# EAGLE design supply (EAGLE 4.13)
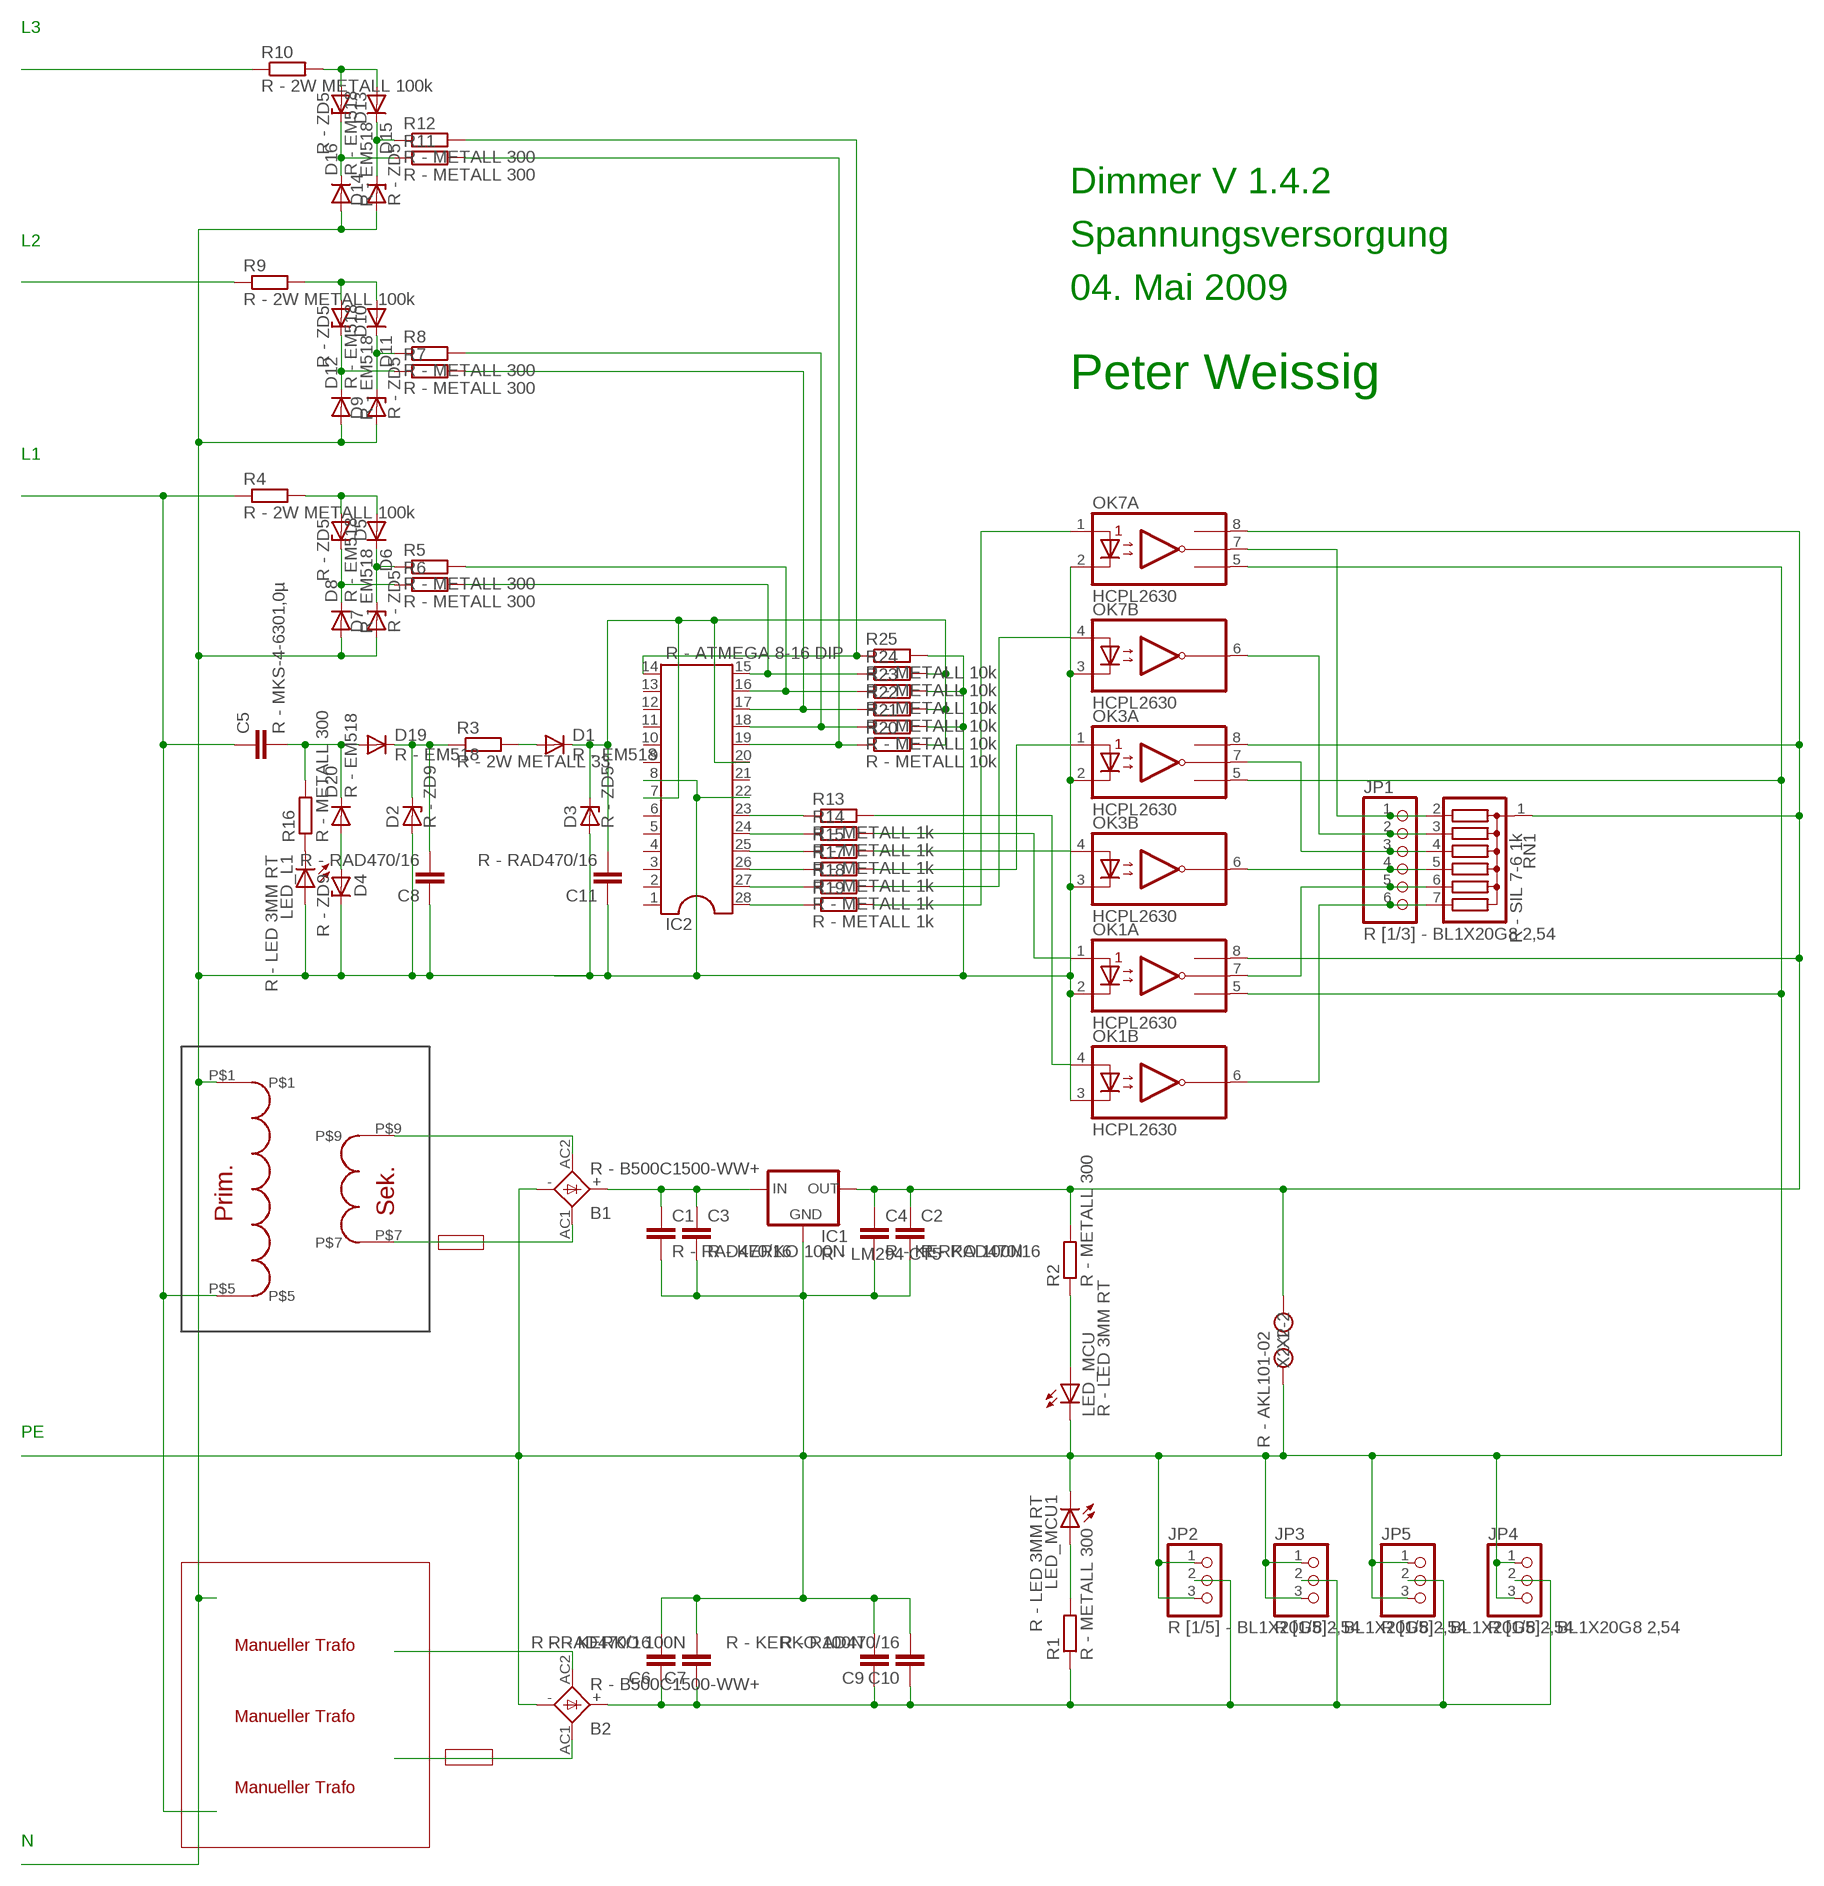
[diagram p0: schematic, sheet 1]

## Parts
B1  R - B500C1500-WW+  2KBP  [2KBP]
B2  R - B500C1500-WW+  2KBP  [2KBP]
C1  R - RAD470/16  C-EU050-075X075  [C050-075X075]
C2  R - RAD470/16  C-EU050-075X075  [C050-075X075]
C3  R - KERKO 100N  C-EU050-025X075  [C050-025X075]
C4  R - KERKO 100N  C-EU050-025X075  [C050-025X075]
C5  R - MKS-4-6301,0µ  C-EU275-134X316  [C275-134X316]
C6  R - RAD470/16  C-EU050-075X075  [C050-075X075]
C7  R - KERKO 100N  C-EU050-025X075  [C050-025X075]
C8  R - RAD470/16  C-EU050-075X075  [C050-075X075]
C9  R - KERKO 100N  C-EU050-025X075  [C050-025X075]
C10  R - RAD470/16  C-EU050-075X075  [C050-075X075]
C11  R - RAD470/16  C-EU050-075X075  [C050-075X075]
D1  R - EM518  1N4004  [DO41-10]
D2  R - ZD9  BZX85  [DO41Z10]
D3  R - ZD5  BZX85  [DO41Z10]
D4  R - ZD9  BZX85  [DO41Z10]
D5  R - ZD5  BZX85  [DO41Z10]
D6  R - EM518  1N4004  [DO41-10]
D7  R - ZD5  BZX85  [DO41Z10]
D8  R - EM518  1N4004  [DO41-10]
D9  R - ZD5  BZX85  [DO41Z10]
D10  R - ZD5  BZX85  [DO41Z10]
D11  R - EM518  1N4004  [DO41-10]
D12  R - EM518  1N4004  [DO41-10]
D13  R - ZD5  BZX85  [DO41Z10]
D14  R - ZD5  BZX85  [DO41Z10]
D15  R - EM518  1N4004  [DO41-10]
D16  R - EM518  1N4004  [DO41-10]
D19  R - EM518  1N4004  [DO41-10]
D20  R - EM518  1N4004  [DO41-10]
IC1  R - LM294 CT5  78XXS  [78XXS]
IC2  R - ATMEGA 8-16 DIP  DIL28-3  [DIL28-3]
JP1  R [1/3] - BL1X20G8 2,54  PINHD-1X6  [1X06]
JP2  R [1/5] - BL1X20G8 2,54  PINHD-1X3  [1X03]
JP3  R [1/5] - BL1X20G8 2,54  PINHD-1X3  [1X03]
JP4  R [1/5] - BL1X20G8 2,54  PINHD-1X3  [1X03]
JP5  R [1/5] - BL1X20G8 2,54  PINHD-1X3  [1X03]
LED_L1  R - LED 3MM RT  LED3MM  [LED3MM]
LED_MCU  R - LED 3MM RT  LED3MM  [LED3MM]
LED_MCU1  R - LED 3MM RT  LED3MM  [LED3MM]
OK1  HCPL2630  [DIL08]
OK3  HCPL2630  [DIL08]
OK7  HCPL2630  [DIL08]
R1  R - METALL 300  R-EU_0207/10  [0207/10]
R2  R - METALL 300  R-EU_0207/10  [0207/10]
R3  R - 2W METALL 33  R-EU_0617/17  [0617/17]
R4  R - 2W METALL 100k  R-EU_0617/17  [0617/17]
R5  R - METALL 300  R-EU_0207/10  [0207/10]
R6  R - METALL 300  R-EU_0207/10  [0207/10]
R7  R - METALL 300  R-EU_0207/10  [0207/10]
R8  R - METALL 300  R-EU_0207/10  [0207/10]
R9  R - 2W METALL 100k  R-EU_0617/17  [0617/17]
R10  R - 2W METALL 100k  R-EU_0617/17  [0617/17]
R11  R - METALL 300  R-EU_0207/10  [0207/10]
R12  R - METALL 300  R-EU_0207/10  [0207/10]
R13  R - METALL 1k  R-EU_0207/10  [0207/10]
R14  R - METALL 1k  R-EU_0207/10  [0207/10]
R15  R - METALL 1k  R-EU_0207/10  [0207/10]
R16  R - METALL 300  R-EU_0207/10  [0207/10]
R17  R - METALL 1k  R-EU_0207/10  [0207/10]
R18  R - METALL 1k  R-EU_0207/10  [0207/10]
R19  R - METALL 1k  R-EU_0207/10  [0207/10]
R20  R - METALL 10k  R-EU_0207/10  [0207/10]
R21  R - METALL 10k  R-EU_0207/10  [0207/10]
R22  R - METALL 10k  R-EU_0207/10  [0207/10]
R23  R - METALL 10k  R-EU_0207/10  [0207/10]
R24  R - METALL 10k  R-EU_0207/10  [0207/10]
R25  R - METALL 10k  R-EU_0207/10  [0207/10]
RN1  R - SIL 7-6 1k  G06R  [SIL7]
U$1  R - 387.06-1  TRAFO387  [TRAFO387]
X2  R - AKL101-02  W237-102  [W237-102]

## Nets
GND: B1.- B2.- C1.2 C2.2 C3.2 C4.2 C6.2 C7.2 C9.2 C10.2 IC1.GND JP2.1 JP2.3 JP3.1 JP3.3 JP4.1 JP4.3 JP5.1 JP5.3 LED_MCU1.K(C) LED_MCU.K(C) OK1.5(A:GND) OK3.5(A:GND) OK7.5(A:GND) X2.2
N$2: B1.AC1 U$1.P$7
N$3: B1.+ C1.1 C3.1 IC1.IN
N$4: LED_MCU.A R2.1
N$5: D1.A R3.2
N$6: C8.2 D2.C D19.C R3.1
N$7: C11.2 D1.C D3.C IC2.7 IC2.20 R20.2 R22.2 R24.2
N$8: C5.2 D19.A D20.C R16.2
N$9: R9.1
N$11: D4.A D20.A
N$12: R10.1
N$13: OK1.4(B:A2) R13.2
N$14: OK7.1(A:A1) R19.2
N$15: OK3.4(B:A2) R15.2
N$16: B1.AC2 U$1.P$9
N$17: B2.AC1
N$18: B2.+ C6.1 C7.1 C9.1 C10.1 JP2.2 JP3.2 JP4.2 JP5.2 R1.1
N$19: LED_MCU1.A R1.2
N$20: B2.AC2
N$22: OK1.1(A:A1) R14.2
N$23: IC2.23 R13.1
N$24: OK3.1(A:A1) R17.2
N$25: OK7.4(B:A2) R18.2
N$26: IC2.24 R14.1
N$27: JP1.6 OK1.6(B:VO2) RN1.7
N$28: JP1.1 OK7.7(A:VO1) RN1.2
N$29: JP1.5 OK1.7(A:VO1) RN1.6
N$30: IC2.25 R15.1
N$32: IC2.26 R17.1
N$33: IC2.27 R18.1
N$34: IC2.28 R19.1
N$36: JP1.4 OK3.6(B:VO2) RN1.5
N$37: JP1.3 OK3.7(A:VO1) RN1.4
N$38: IC2.14 R12.2 R25.1
N$39: D5.A D6.A R4.2
N$40: D5.C D8.C R6.1
N$42: IC2.16 R5.2 R23.1
N$43: D6.C D7.C R5.1
N$44: IC2.19 R11.2 R20.1
N$45: JP1.2 OK7.6(B:VO2) RN1.3
N$46: IC2.15 R6.2 R24.1
N$48: IC2.18 R8.2 R21.1
N$50: LED_L1.K(C) R16.1
N$51: IC2.17 R7.2 R22.1
N$54: D13.C D16.C R11.1
N$55: D13.A D15.A R10.2
N$56: D10.C D12.C R7.1
N$57: D9.C D11.C R8.1
N$58: D10.A D11.A R9.2
N$59: D14.C D15.C R12.1
NULLLEITER: C8.1 C11.1 D2.A D3.A D4.C D7.A D8.A D9.A D12.A D14.A D16.A IC2.8 IC2.22 LED_L1.A OK1.2(A:C1) OK1.3(B:C2) OK3.2(A:C1) OK3.3(B:C2) OK7.2(A:C1) OK7.3(B:C2) R21.2 R23.2 R25.2 U$1.P$1
PHASE1: C5.1 R4.1 U$1.P$5
VCC: C2.1 C4.1 IC1.OUT OK1.8(A:VCC) OK3.8(A:VCC) OK7.8(A:VCC) R2.2 RN1.1 X2.1
Unconnected: IC2.1 IC2.2 IC2.3 IC2.4 IC2.5 IC2.6 IC2.9 IC2.10 IC2.11 IC2.12 IC2.13 IC2.21

## Notes on the sheet
- L3
- Dimmer V 1.4.2
- L2 | Spannungsversorgung
- 04. Mai 2009
- Peter Weissig
- L1
- PE
- Manueller Trafo
- Manueller Trafo
- Manueller Trafo
- N

## Library data of the parts
B1 B2 = rectifier:2KBP: RECTIFIER grid 3 x 3,81 mm
C1-C11 = rcl:C-EU: CAPACITOR, European symbol
D1 D6 D8 D11 D12 D15 D16 D19 D20 = diode:1N4004: DIODE general purpose rectifier, 1 A
D2-D5 D7 D9 D10 D13 D14 = diode:BZX85: Z DIODE
IC1 = v-reg:78XXS: VOLTAGE REGULATOR
IC2 = ic-package:DIL28: Dual In Line
JP1 = pinhead:PINHD-1X6: PIN HEADER
JP2-JP5 = pinhead:PINHD-1X3: PIN HEADER
LED_L1 LED_MCU LED_MCU1 = led:LED: LED OSRAM: - CHIPLED LG R971, LG N971, LY N971, LG Q971, LY Q971, LO R971, LY R971 LH N974, LH R974 LS Q976, LO Q976, LY Q976 LO Q996 - Hyper CHIPLED LW Q18S LB Q993, LB Q99A, LB R99A - SideLED LS A670, LO A670, LY A670, LG A670, LP A670 LB A673, LV A673, LT A673, LW A673 LH A674 LY A675 LS A676, LA A676, LO A676, LY A676, LW A676 LS A679, LY A679, LG A679 - Hyper Micro SIDELED® LS Y876, LA Y876, LO Y876, LY Y876 LT Y87S - SmartLED LW L88C, LW L88S LB L89C, LB L89S, LG L890 LS L89K, LO L89K, LY L89K LS L896, LA L896, LO L896, LY L896 - TOPLED LS T670, LO T670, LY T670, LG T670, LP T670 LSG T670, LSP T670, LSY T670, LOP T670, LYG T670 LG T671, LOG T671, LSG T671 LB T673, LV T673, LT T673, LW T673 LH T674 LS T676, LA T676, LO T676, LY T676, LB T676, LH T676, LSB T676, LW T676 LB T67C, LV T67C, LT T67C, LS T67K, LO T67K, LY T67K, LW E67C LS E67B, LA E67B, LO E67B, LY E67B, LB E67C, LV E67C, LT E67C LW T67C LS T679, LY T679, LG T679 LS T770, LO T770, LY T770, LG T770, LP T770 LB T773, LV T773, LT T773, LW T773 LH T774 LS E675, LA E675, LY E675, LS T675 LS T776, LA T776, LO T776, LY T776, LB T776 LHGB T686 LT T68C, LB T68C - Hyper Mini TOPLED® LB M676 - Mini TOPLED Santana® LG M470 LS M47K, LO M47K, LY M47K Source: http://www.osram.convergy.de/
OK1 OK3 OK7 = optocoupler:HCPL2630: HEWLETT PACKARD OPTO COUPLER
R1-R25 = rcl:R-EU_: RESISTOR, European symbol
RN1 = resistor-sil:G06R: SIL RESISTOR
U$1 = Meine eigene:TRAFO387
X2 = con-wago-500:W237-102: WAGO SCREW CLAMP

## Board
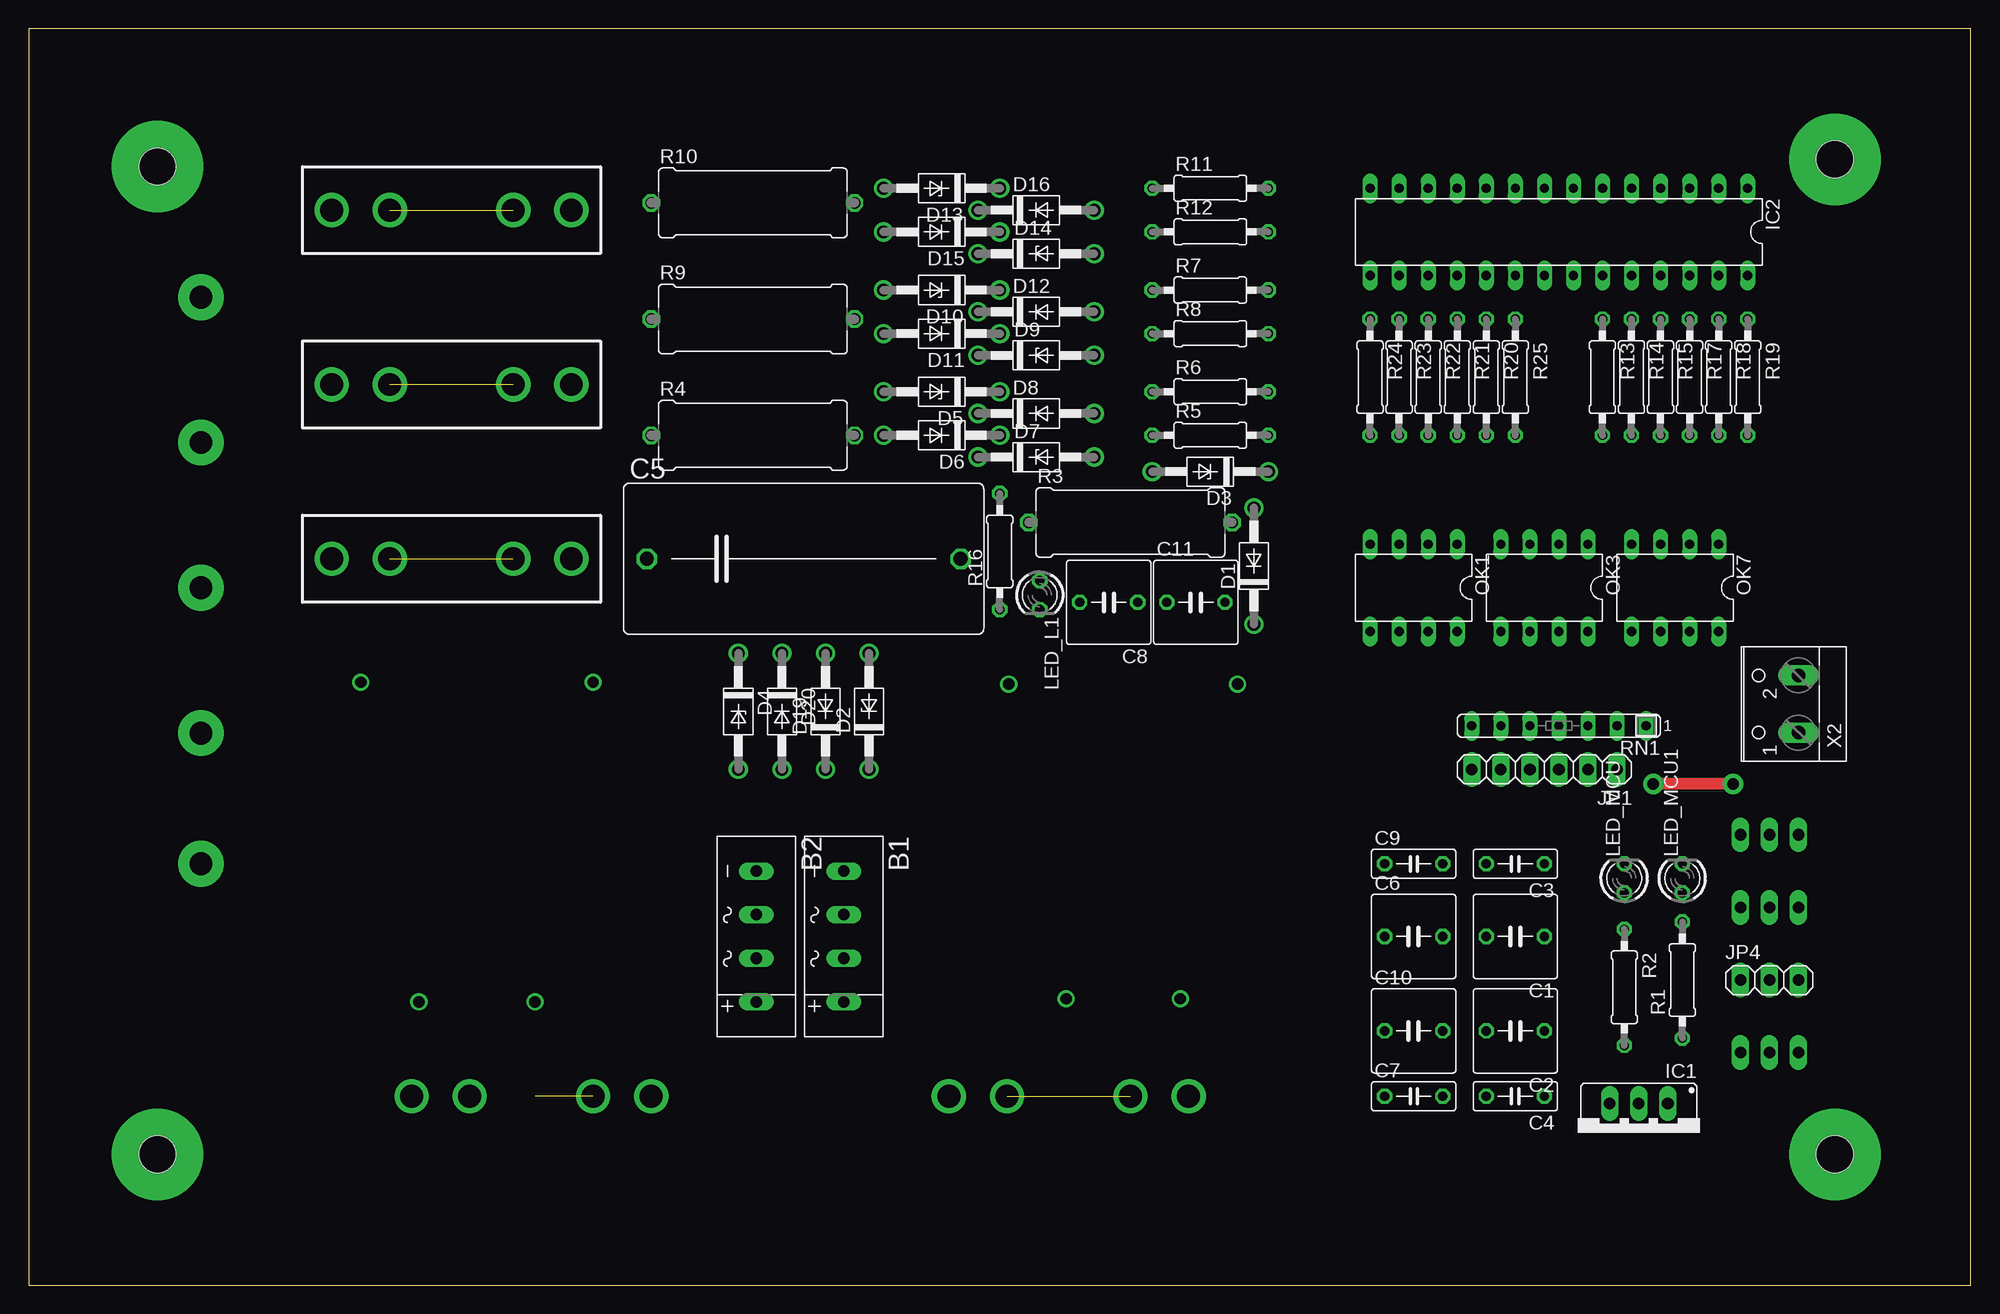
[diagram p1: board, top side]
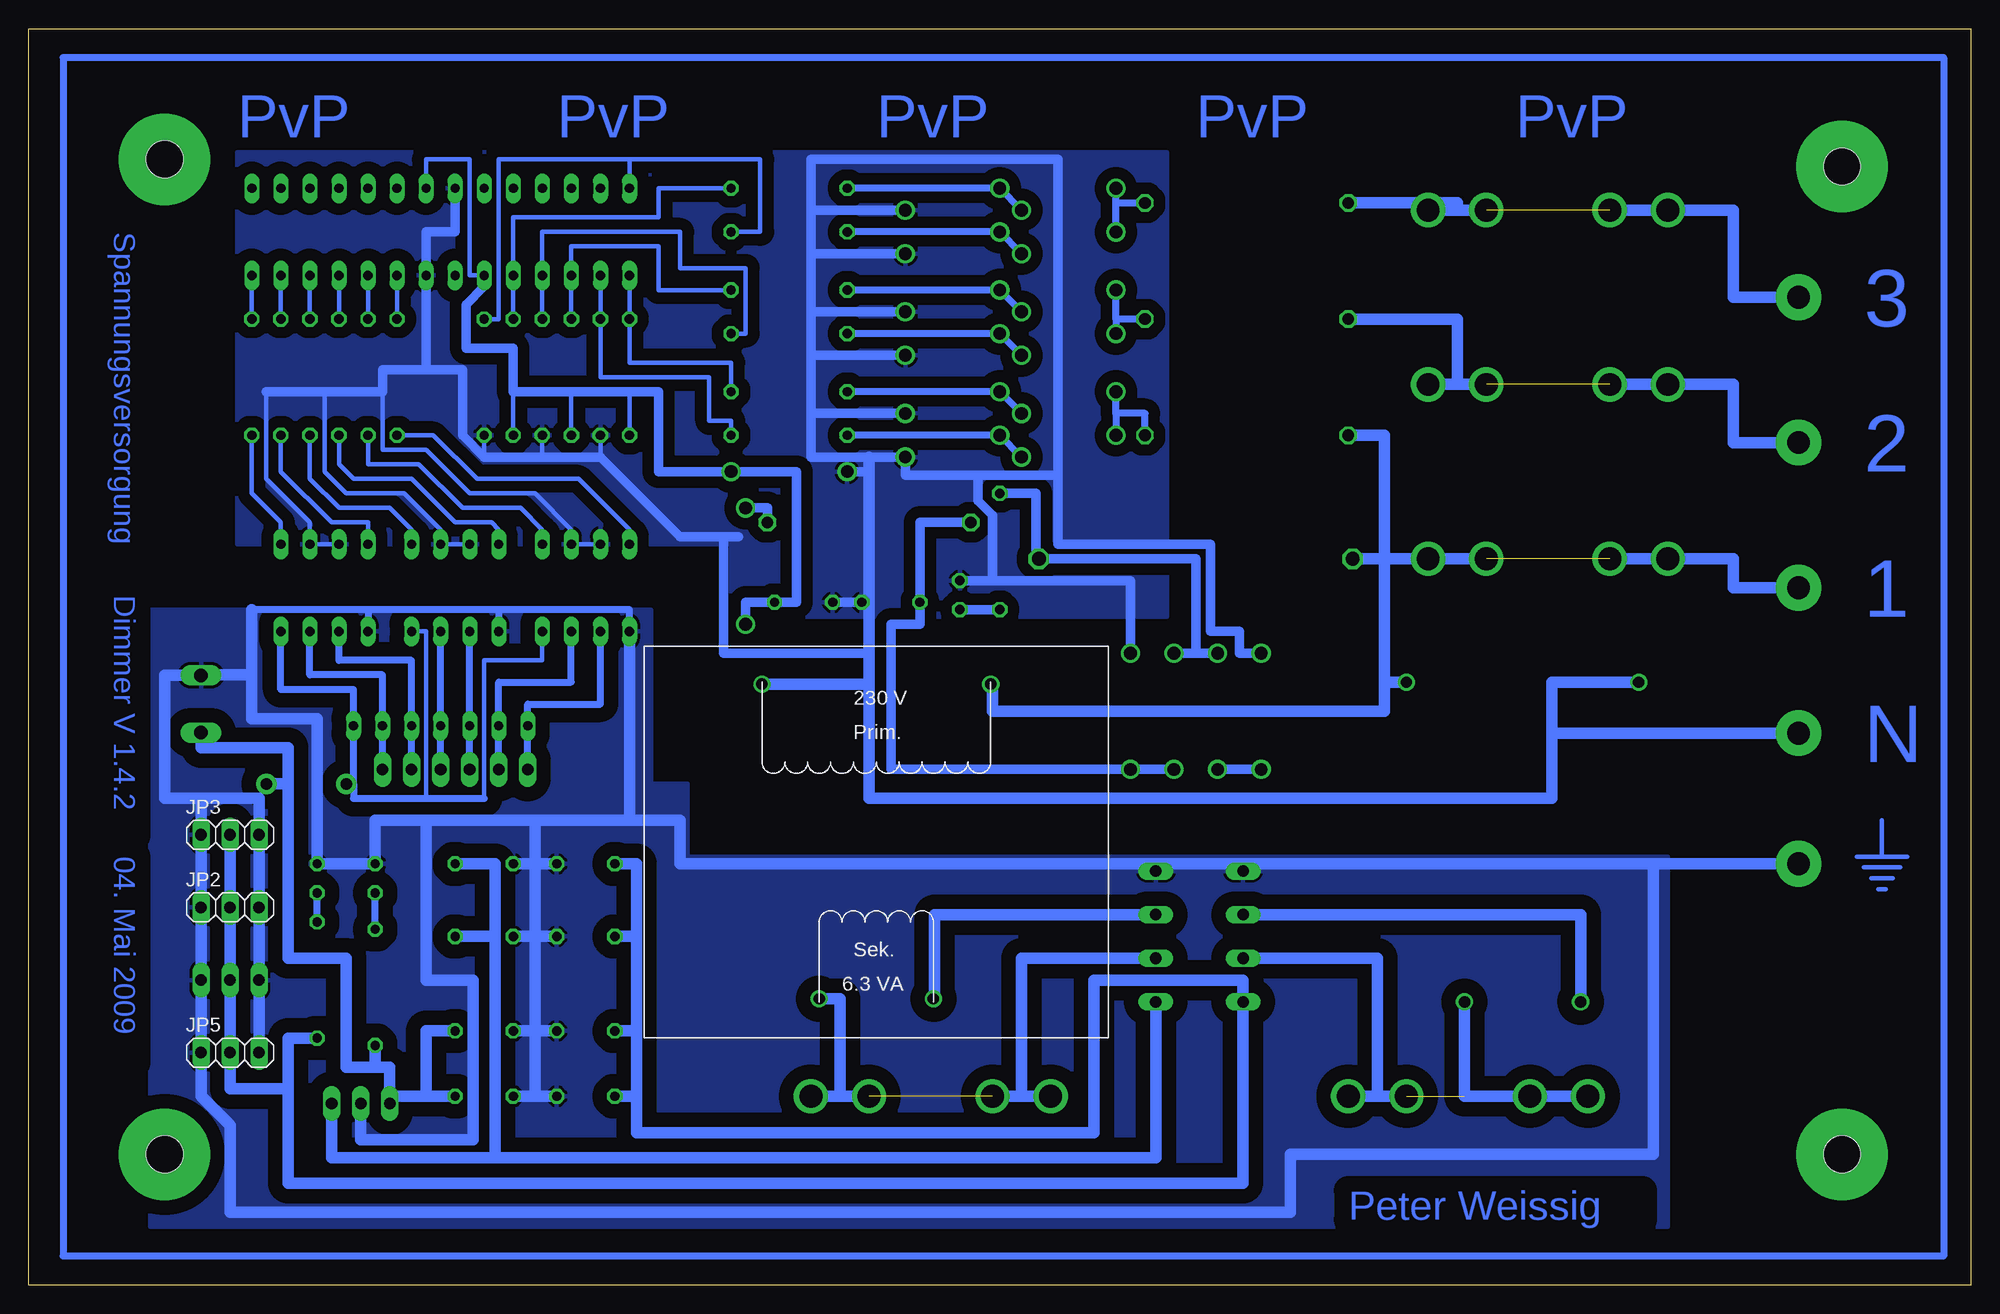
[diagram p2: board, bottom side, seen from below]

Size 169.85 x 109.84 mm. Coordinates in mm from the lower left corner, seen from the top.
Outline: 0,0 169.85,0 169.85,109.84 0,109.84 0,0
Copper layers (1*16): Top 0.035mm / dielectric 1.5mm / Bottom 0.035mm
Design rules "default": minimum track width 10mil, minimum drill 24mil, track to track 8mil, track to pad 8mil, pad to pad 8mil, via to via 8mil, smd to smd 8mil, copper to edge 40mil, drill to drill 8mil, minimum pad ring 10mil, minimum via ring 8mil, stop-mask expansion 4mil, vias tented up to drill 0mil, thermal gap 10mil
Holes 3.2 mm at 157.95,98.42 157.95,11.42 11.27,11.42 11.27,97.78

### Footprints (pad centres in the part's own frame; a part is rotated, then mirrored left to right if it is on the bottom)
2KBP = drill 1.016 long: + 5.715,0; - -5.715,0; AC1 -1.905,0; AC2 1.905,0
C050-075X075 = drill 0.813 octagon: 1 -2.54,0; 2 2.54,0
C050-025X075 = drill 0.813 octagon: 1 -2.54,0; 2 2.54,0
C275-134X316 = drill 1.194 octagon: 1 -13.716,0; 2 13.716,0
DO41-10 = drill 1.118 round: A 5.08,0; C -5.08,0
DO41Z10 = drill 1.118 round: A 5.08,0; C -5.08,0
78XXS = drill 1.016 long: GND 0,-2.54; IN -2.54,-2.54; OUT 2.54,-2.54
DIL28-3 = drill 0.813 long: 1 -16.51,-3.81; 2 -13.97,-3.81; 3 -11.43,-3.81; 4 -8.89,-3.81; 5 -6.35,-3.81; 6 -3.81,-3.81; 7 -1.27,-3.81; 8 1.27,-3.81; 9 3.81,-3.81; 10 6.35,-3.81; 11 8.89,-3.81; 12 11.43,-3.81; 13 13.97,-3.81; 14 16.51,-3.81; 15 16.51,3.81; 16 13.97,3.81; 17 11.43,3.81; 18 8.89,3.81; 19 6.35,3.81; 20 3.81,3.81; 21 1.27,3.81; 22 -1.27,3.81; 23 -3.81,3.81; 24 -6.35,3.81; 25 -8.89,3.81; 26 -11.43,3.81; 27 -13.97,3.81; 28 -16.51,3.81
1X06 = drill 1.016 long: 1 -6.35,0; 2 -3.81,0; 3 -1.27,0; 4 1.27,0; 5 3.81,0; 6 6.35,0
1X03 = drill 1.016 long: 1 -2.54,0; 2 0,0; 3 2.54,0
LED3MM = drill 0.813 octagon: A -1.27,0; K 1.27,0
DIL08 = drill 0.813 long: 1 -3.81,-3.81; 2 -1.27,-3.81; 3 1.27,-3.81; 4 3.81,-3.81; 5 3.81,3.81; 6 1.27,3.81; 7 -1.27,3.81; 8 -3.81,3.81
0207/10 = drill 0.813 octagon: 1 -5.08,0; 2 5.08,0
0617/17 = drill 1.016 octagon: 1 -8.89,0; 2 8.89,0
SIL7 = drill 0.813 long: 1 -7.62,0; 2 -5.08,0; 3 -2.54,0; 4 0,0; 5 2.54,0; 6 5.08,0; 7 7.62,0
TRAFO387 = drill 1 round: P$1 -10,13.8; P$5 10,13.8; P$7 5,-13.7; P$9 -5,-13.7
W237-102 = drill 1.194 long: 1 -2.5,-1.27; 2 2.5,-1.27

### Placement (x,y rotation side)
B1  71.27,30.48 270 top
B2  63.65,30.48 270 top
C1  130.01,30.48 180 top
C2  130.01,22.22 180 top
C3  130.01,36.83 180 top
C4  130.01,16.5 180 top
C5  67.78,63.49 0 top
C6  121.12,30.48 0 top
C7  121.12,16.5 0 top
C8  94.45,59.69 180 top
C9  121.12,36.83 0 top
C10  121.12,22.22 0 top
C11  102.07,59.69 0 top
D1  107.15,62.86 90 top
D2  73.5,50.16 90 top
D3  103.34,71.12 180 top
D4  62.07,50.16 270 top
D5  79.84,78.1 180 top
D6  79.84,74.29 180 top
D7  88.1,72.38 0 top
D8  88.1,76.19 0 top
D9  88.1,81.28 0 top
D10  79.84,86.99 180 top
D11  79.84,83.18 180 top
D12  88.1,85.08 0 top
D13  79.84,95.88 180 top
D14  88.1,90.17 0 top
D15  79.84,92.07 180 top
D16  88.1,93.97 0 top
D19  69.69,50.16 90 top
D20  65.88,50.16 270 top
IC1  140.81,13.33 180 top
IC2  133.82,92.07 180 top
JP1  132.55,45.08 180 top
JP2  152.24,33.02 0 bottom
JP3  152.24,39.36 0 bottom
JP4  152.24,26.66 0 top
JP5  152.24,20.31 0 bottom
LED_L1  88.42,60.32 270 top
LED_MCU  139.53,35.55 90 top
LED_MCU1  144.62,35.55 90 top
OK1  121.12,60.95 180 top
OK3  132.55,60.95 180 top
OK7  143.98,60.95 180 top
R1  144.62,26.66 90 top
R2  139.53,26.03 270 top
R3  96.36,66.67 0 top
R4  63.34,74.29 0 top
R5  103.34,74.29 0 top
R6  103.34,78.1 0 top
R7  103.34,86.99 0 top
R8  103.34,83.18 0 top
R9  63.34,84.45 0 top
R10  63.34,94.61 0 top
R11  103.34,95.88 0 top
R12  103.34,92.07 0 top
R13  137.63,79.37 270 top
R14  140.17,79.37 270 top
R15  142.71,79.37 270 top
R16  84.92,64.13 90 top
R17  145.25,79.37 270 top
R18  147.79,79.37 270 top
R19  150.33,79.37 270 top
R20  127.47,79.37 270 top
R21  124.93,79.37 270 top
R22  122.39,79.37 270 top
R23  119.85,79.37 270 top
R24  117.31,79.37 270 top
R25  130.01,79.37 270 top
RN1  133.82,48.89 180 top
U$1  95.72,38.73 0 bottom
X2  153.5,50.8 90 top

### Tracks (layer width: path | path; a pad name or v marks a point on that pad's centre or on a via)
GND  (via drill 2 pad 4)
  Bottom 0.61: 128.74,59.05 117.31,59.05 OK1.5 | 128.74,59.05 140.17,59.05 | 140.17,59.05 150.33,59.05 | 140.17,59.05 OK7.5 | 128.74,59.05 OK3.5 | 128.11,40.63 137.63,40.63
  Bottom 1.016: 27.78,36.83 v15.08,36.83 | 27.78,36.83 63.97,36.83 | 63.97,36.83 70.95,36.83 | 70.95,36.83 112.87,36.83 112.87,40.63 117.31,40.63 | 117.31,40.63 125.56,40.63 | 125.56,40.63 128.11,40.63 135.09,40.63 | 125.56,16.5 C7.2 | 125.56,40.63 125.56,36.83 | 125.56,36.83 125.56,30.48 | 125.56,30.48 125.56,22.22 | 125.56,22.22 125.56,16.5 | 125.56,22.22 C10.2 | 125.56,22.22 C2.2 | 125.56,16.5 C4.2 | 125.56,30.48 C6.2 | 125.56,30.48 C1.2 | 125.56,36.83 C3.2 | 125.56,36.83 C9.2 | IC1.GND 140.81,12.7 130.96,12.7 130.96,26.66 135.09,26.66 135.09,40.63 | 135.09,40.63 137.63,40.63 139.53,40.63 LED_MCU.K LED_MCU1.K 144.62,49.52 150.33,49.52 150.33,53.34 | B2.- 63.97,36.19 63.97,36.83 | B1.- 70.95,36.19 70.95,36.83 | 150.33,53.34 154.78,53.34 X2.2 157.95,53.3 157.95,42.54 154.78,42.54 | 150.33,59.05 150.33,53.34 | 117.31,40.63 OK1.5 | 154.78,42.54 JP3.1 JP2.1 JP4.3 JP5.1 154.78,16.5 152.24,13.96 152.24,6.34 59.53,6.34 59.53,11.42 27.78,11.42 27.78,36.83 | JP5.3 JP4.1 JP2.3 JP3.3 149.69,42.54 154.78,42.54
  pour Bottom (isolate 1.27): 26.51,37.46 26.51,5.07 159.22,5.07 159.22,59.05 115.41,59.05 115.41,43.81 112.23,43.81 112.23,37.46
N$1
  Bottom 0.61: 2.38,2.54 166.84,2.54 166.84,107.31 2.38,107.31 2.38,2.54
N$2
  Bottom 1.016: 90.64,25.03 90.64,24.76 | 90.64,25.03 U$1.P$7 | B1.AC1 90.64,32.38 90.64,25.03
N$3
  Bottom 1.016: 129.06,11.11 129.06,30.48 | 129.06,30.48 129.06,36.83 C3.1 | 129.06,30.48 C1.1 | IC1.IN 143.34,11.11 129.06,11.11 | 129.06,11.11 71.27,11.11 B1.+
N$4
  Bottom 0.61: R2.1 LED_MCU.A
N$5
  Bottom 0.813: R3.2 105.25,67.94 D1.A
N$6
  Bottom 0.813: R3.1 91.91,66.67 C8.2 91.91,57.78 94.45,57.78 94.45,45.08 D2.C D19.C
N$7
  Bottom 0.406: IC2.7 135.09,98.42 131.28,98.42 131.28,88.26 IC2.20 | 117.31,78.1 R24.2 | 122.39,78.1 R22.2 | 127.47,78.1 R20.2
  Bottom 0.813: D1.C 107.15,59.69 C11.2 102.71,59.69 102.71,71.12 D3.C 114.77,71.12 114.77,78.1 117.31,78.1 122.39,78.1 127.47,78.1 127.47,81.91 131.6,81.91 131.6,85.72 130.01,87.31 IC2.20
N$8
  Bottom 0.61: C5.2 81.75,63.49
  Bottom 0.813: D20.C 67.78,55.24 | 67.78,55.24 D19.A | C5.2 67.78,63.49 67.78,55.24 | 81.75,63.49 81.75,69.21 R16.2
N$9  (via drill 2, 2 pad 4)  (1 unrouted)
  Bottom 1.016: v42.38,78.73 44.92,78.73 | 44.92,78.73 v47.46,78.73 | v31.59,78.73 v26.51,78.73 20.79,78.73 20.79,73.66 v15.08,73.66 | R9.1 44.92,84.45 44.92,78.73
N$11
  Bottom 0.813: D4.A D20.A
N$12  (via drill 2, 2 pad 4)  (1 unrouted)
  Bottom 1.016: v15.08,86.36 20.79,86.36 20.79,93.97 v26.51,93.97 v31.59,93.97 | v42.38,93.97 44.92,93.97 | 44.92,93.97 v47.46,93.97 | R10.1 44.92,94.61 44.92,93.97
N$13
  Bottom 0.406: R13.2 134.45,74.29 130.64,70.48 121.75,70.48 117.31,66.03 OK1.4
N$14
  Bottom 0.406: OK7.1 147.79,66.67 150.33,69.21 R19.2
N$15
  Bottom 0.406: OK3.4 128.74,66.03 129.38,66.67 132.55,66.67 136.36,70.48 141.44,70.48 142.71,71.75 R15.2
N$16  (via drill 2)  (1 unrouted)
  Bottom 1.016: 83.02,16.5 v85.56,16.5 | 83.02,16.5 83.02,28.57 B1.AC2 | v80.48,16.5 83.02,16.5 | U$1.P$9 98.9,25.03 98.9,16.5 v96.36,16.5
N$17  (via drill 1)
  Bottom 1.016: B2.AC1 34.12,32.38 v34.12,24.76
N$18
  Bottom 1.016: C9.1 116.68,36.83 116.68,30.48 | 116.68,30.48 C6.1 | 116.68,22.22 116.68,30.48 | 116.68,22.22 C10.1 | 116.68,16.5 116.68,22.22 | 116.68,16.5 C7.1 | 116.68,16.5 116.68,13.33 76.67,13.33 76.67,26.66 63.65,26.66 B2.+ 63.65,8.88 147.16,8.88 147.16,17.14 | JP3.2 JP2.2 JP4.2 JP5.2 152.24,17.14 147.16,17.14 | 147.16,17.14 147.16,21.59 R1.1
N$19
  Bottom 0.61: R1.2 LED_MCU1.A
N$20  (via drill 1, 2)  (1 unrouted)
  Bottom 1.016: v38.57,16.5 v33.49,16.5 44.29,16.5 v44.29,24.76 | 51.91,16.5 v49.37,16.5 | v54.45,16.5 51.91,16.5 | 51.91,16.5 51.91,28.57 B2.AC2
N$21  (via drill 2)
  Bottom 1.016: 96.36,16.5 v101.44,16.5
N$22
  Bottom 0.406: OK1.1 124.93,66.03 126.84,67.94 131.92,67.94 135.73,71.75 140.17,71.75 R14.2
N$23
  Bottom 0.406: R13.1 IC2.23
N$24
  Bottom 0.406: OK3.1 136.36,66.03 138.26,67.94 142.71,67.94 145.25,70.48 R17.2
N$25
  Bottom 0.406: OK7.4 140.17,66.67 143.34,66.67 147.79,71.12 R18.2
N$26
  Bottom 0.406: R14.1 IC2.24
N$27
  Bottom 0.61: OK1.6 119.85,50.8 126.2,50.8 RN1.7 JP1.6
N$28
  Bottom 0.61: OK7.7 145.25,53.34 138.9,53.34 RN1.2 JP1.1
N$29
  Bottom 0.61: OK1.7 122.39,52.7 128.74,52.7 RN1.6 JP1.5
N$30
  Bottom 0.406: R15.1 IC2.25
N$31  (via drill 3.2 pad 8)
  other vias: 11.27,11.42
N$32
  Bottom 0.406: R17.1 IC2.26
N$33
  Bottom 0.406: R18.1 IC2.27
N$34
  Bottom 0.406: R19.1 IC2.28
N$35  (via drill 3.2 pad 8)
  other vias: 11.27,97.78
N$36
  Bottom 0.61: OK3.6 RN1.5 JP1.4
N$37
  Bottom 0.61: OK3.7 RN1.4 JP1.3
N$38
  Bottom 0.406: 117.31,98.42 IC2.14 | 117.31,98.42 128.74,98.42 128.74,84.45 R25.1 | 117.31,98.42 105.88,98.42 105.88,92.07 R12.2
N$39
  Bottom 0.61: R4.2 72.22,76.19 74.77,76.19 | 74.77,76.19 D6.A | 74.77,76.19 D5.A
N$40
  Bottom 0.61: R6.1 D5.C D8.C
N$41  (via drill 3.2 pad 8)
  other vias: 157.95,98.42
N$42
  Bottom 0.406: R5.2 108.42,75.56 110.33,75.56 110.33,79.37 119.85,79.37 R23.1 IC2.16
N$43
  Bottom 0.61: D7.C D6.C R5.1
N$44
  Bottom 0.406: R20.1 IC2.19 127.47,93.34 114.77,93.34 114.77,95.88 R11.2
N$45
  Bottom 0.61: OK7.6 142.71,54.6 136.36,54.6 RN1.3 JP1.2
N$46
  Bottom 0.406: IC2.15 R24.1 117.31,80.64 108.42,80.64 R6.2
N$47  (via drill 3.2 pad 8)
  other vias: 157.95,11.42
N$48
  Bottom 0.406: R8.2 107.15,83.18 107.15,88.89 112.87,88.89 112.87,92.07 124.93,92.07 IC2.18 R21.1
N$50
  Bottom 0.813: R16.1 LED_L1.K
N$51
  Bottom 0.406: R7.2 114.77,86.99 114.77,90.8 122.39,90.8 IC2.17 R22.1
N$52
  Bottom 0.406: 7.77,37.46 5.55,37.46 | 7.77,37.46 10,37.46 | 7.77,40.63 7.77,37.46
N$53
  Bottom 0.406: 9.36,36.51 6.19,36.51
N$54
  Bottom 0.61: D16.C D13.C R11.1
N$55
  Bottom 0.61: 74.77,94.61 R10.2 | 74.77,94.61 D13.A | D15.A 74.77,94.61
N$56
  Bottom 0.61: R7.1 D10.C D12.C
N$57
  Bottom 0.61: D11.C R8.1 | D11.C 92.55,83.18 | D9.C D11.C
N$58
  Bottom 0.61: 74.77,84.45 D11.A | R9.2 74.77,84.45 | 74.77,84.45 D10.A
N$59
  Bottom 0.61: D14.C D15.C R12.1
N$60
  Bottom 0.406: 8.73,35.55 6.82,35.55
NULLLEITER  (via drill 1, 2 pad 4)
  Bottom 0.406: OK1.3 OK1.2 122.39,66.03 125.56,69.21 131.28,69.21 135.09,73.02 138.9,73.02 138.9,78.1 | 143.98,78.1 143.98,71.12 142.07,69.21 137,69.21 133.82,66.03 OK3.2 OK3.3 | 149.06,78.1 149.06,70.48 145.25,66.67 OK7.2 OK7.3 | 119.85,72.38 R23.2 | 124.93,72.38 R21.2 | 130.01,72.38 R25.2
  Bottom 0.61: 96.36,59.69 C8.1
  Bottom 0.813: 96.36,59.69 C11.1 | 149.06,78.1 143.98,78.1 138.9,78.1 138.9,80 135.09,80 | IC2.8 132.55,92.07 135.09,92.07 IC2.22 135.09,80 | 109.06,65.4 107.78,65.4 | 109.06,65.4 112.87,65.4 119.85,72.38 124.93,72.38 130.01,72.38 131.92,74.29 131.92,80 135.09,80 | 101.44,76.19 101.44,72.38 96.36,72.38 D7.A 93.18,70.8 86.83,70.8 | 101.44,76.19 101.44,81.28 | 101.44,81.28 101.44,85.08 | 101.44,85.08 101.44,90.17 | 101.44,90.17 101.44,93.97 | 101.44,81.28 D9.A | D4.C 63.97,55.24 63.97,57.14 66.51,57.14 66.51,64.77 79.84,64.77 79.84,70.48 | D2.A 73.5,61.59 LED_L1.A 85.56,61.59 85.56,67.31 86.83,68.58 86.83,70.8 | 79.84,70.48 79.84,70.8 86.83,70.8 | 96.36,71.12 D3.A | 96.36,55.24 109.06,55.24 109.06,65.4 | 101.44,93.97 101.44,98.42 79.84,98.42 79.84,70.48 | 101.44,93.97 D16.A | 101.44,90.17 D14.A | 101.44,85.08 D12.A | 101.44,76.19 D8.A
  Bottom 1.016: v15.08,48.26 36.67,48.26 | 36.67,48.26 36.67,52.7 v29.05,52.7 | 36.67,48.26 36.67,42.54 96.36,42.54 96.36,52.53 | 96.36,52.53 U$1.P$1 | 96.36,52.53 96.36,55.24 96.36,59.69 96.36,71.12 96.36,72.38
  pour Bottom (isolate 1.016): 151.6,99.05 151.6,64.77 108.42,64.77 108.42,58.41 70.32,58.41 70.32,99.05
PHASE1  (via drill 1, 2, 2 pad 4)  (1 unrouted)
  Bottom 1.016: v31.59,63.49 v26.51,63.49 20.79,63.49 20.79,60.95 v15.08,60.95 | v42.38,63.49 v47.46,63.49 51.27,63.49 | 51.27,63.49 53.81,63.49 | 53.81,63.49 53.98,63.49 | 53.81,63.49 C5.1 51.27,63.49 | 51.27,52.7 51.27,63.49 | 85.72,52.7 U$1.P$5 85.56,52.53 | 51.27,52.7 v49.37,52.7 | 51.27,52.7 51.27,50.16 85.56,50.16 85.56,52.53 | 85.56,52.53 85.56,52.7 | R4.1 51.27,74.29 51.27,63.49
S$1
  Bottom 0.406: 8.09,34.6 7.46,34.6
VCC  (via drill 1 pad 1.78)
  Top 1.016: v149.06,43.81 v142.07,43.81
  Bottom 0.406: OK3.8 135.09,57.14 135.09,42.54 | OK1.8 124.93,54.6 130.01,54.6 130.01,42.54
  Bottom 0.61: 141.44,42.54 135.09,42.54 130.01,42.54 | 141.44,42.54 140.17,42.54 | 141.44,43.81 141.44,42.54 | 141.44,43.81 RN1.1 141.44,52.06 147.79,52.06 OK7.8 | v142.07,43.81 141.44,43.81
  Bottom 1.016: 139.53,19.04 138.26,19.04 IC1.OUT 138.26,16.5 135.09,16.5 | 139.53,19.04 142.07,19.04 142.07,28.57 147.16,28.57 147.16,43.81 | 147.16,43.81 v149.06,43.81 | C4.1 135.09,16.5 | C2.1 135.09,22.22 135.09,16.5 | X2.1 154.78,46.98 147.16,46.98 147.16,43.81 | 139.53,19.04 R2.2

### Text on the board
Bottom: PvP | PvP | PvP | PvP | PvP | Spannungsversorgung | 3 | 2 | Dimmer V 1.4.2 | 1 | N | 04. Mai 2009 | Peter Weissig